# Altium schematic sheet digital led panel.SchDoc
size 369 x 240 mm; SheetNumber: 1; SheetTotal: 1; SPICEModelCacheRHZGLBES: <root> / <DocumentId>RHZGLBES</DocumentId> / </root>
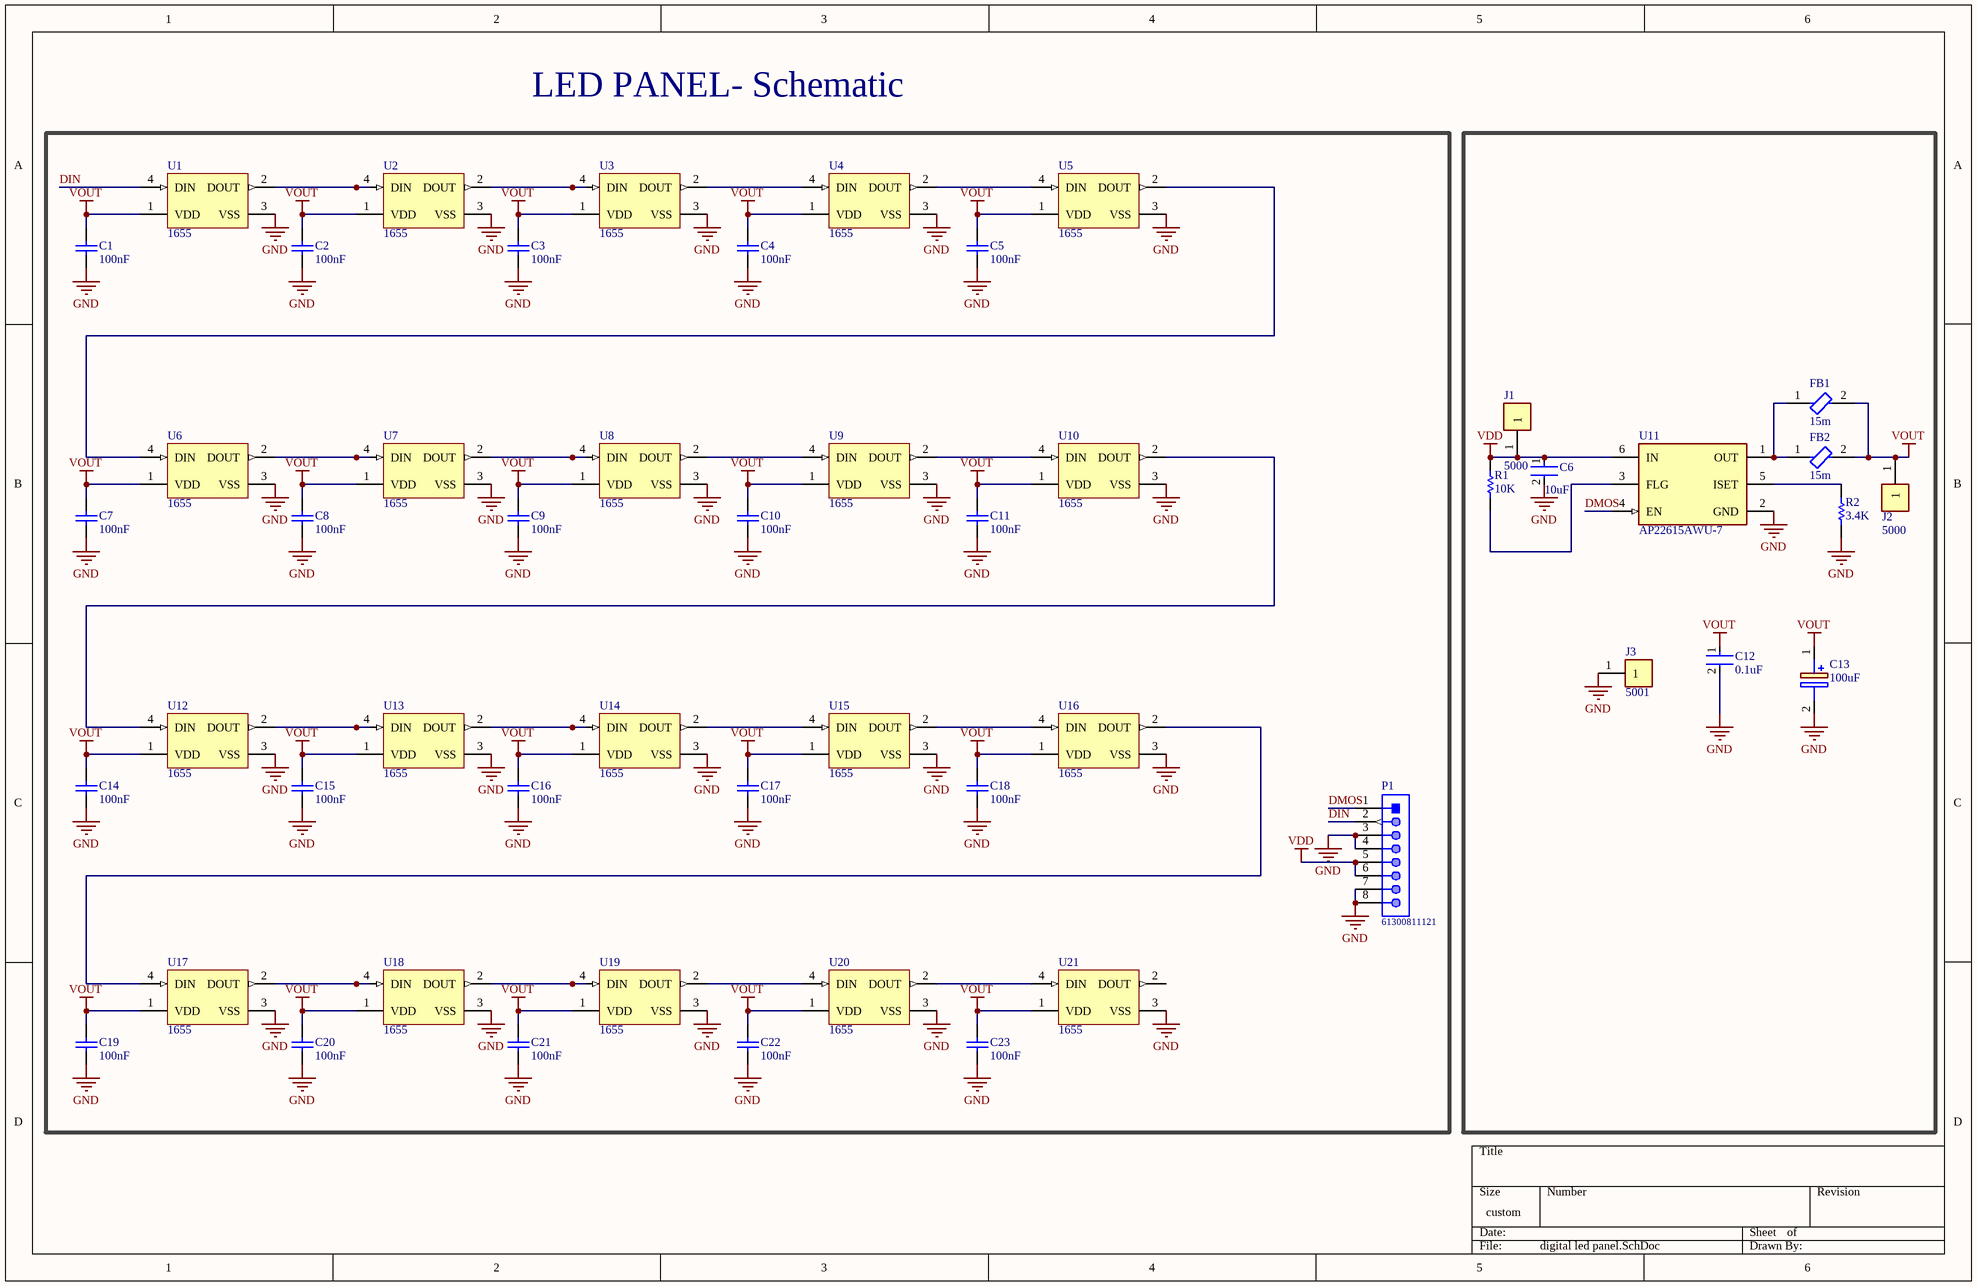
[diagram p0: digital led panel.SchDoc]

## Parts
C1  100nF  [KEMT-1206-2_M]
C2  100nF  [KEMT-1206-2_M]
C3  100nF  [KEMT-1206-2_M]
C4  100nF  [KEMT-1206-2_M]
C5  100nF  [KEMT-1206-2_M]
C6  10uF  [FP-1206-L_3_2_0_2-W_1_6_0-IPC_A]
C7  100nF  [KEMT-1206-2_M]
C8  100nF  [KEMT-1206-2_M]
C9  100nF  [KEMT-1206-2_M]
C10  100nF  [KEMT-1206-2_M]
C11  100nF  [KEMT-1206-2_M]
C12  0.1uF  [FP-C1206C-EB-MFG]
C13  100uF  [CAPAE660X565N]
C14  100nF  [KEMT-1206-2_M]
C15  100nF  [KEMT-1206-2_M]
C16  100nF  [KEMT-1206-2_M]
C17  100nF  [KEMT-1206-2_M]
C18  100nF  [KEMT-1206-2_M]
C19  100nF  [KEMT-1206-2_M]
C20  100nF  [KEMT-1206-2_M]
C21  100nF  [KEMT-1206-2_M]
C22  100nF  [KEMT-1206-2_M]
C23  100nF  [KEMT-1206-2_M]
FB1  15m  [FP-BLM21-0_2-t0_85-e0_5-d-IPC_B]
FB2  15m  [FP-BLM21-0_2-t0_85-e0_5-d-IPC_B]
J1  5000  [FP-5000-MFG]
J2  5000  [FP-5000-MFG]
J3  5001  [FP-5001-MFG]
P1  61300811121  [61300811121]
R1  10K  [RESC3116X65X40ML10T20]
R2  3.4K  [RESC3216X70X50LL05T20]
U1  1655  [ADA-RGB-1655_V]
U2  1655  [ADA-RGB-1655_V]
U3  1655  [ADA-RGB-1655_V]
U4  1655  [ADA-RGB-1655_V]
U5  1655  [ADA-RGB-1655_V]
U6  1655  [ADA-RGB-1655_V]
U7  1655  [ADA-RGB-1655_V]
U8  1655  [ADA-RGB-1655_V]
U9  1655  [ADA-RGB-1655_V]
U10  1655  [ADA-RGB-1655_V]
U11  AP22615AWU-7  [FP-TSOT26-IPC_B]
U12  1655  [ADA-RGB-1655_V]
U13  1655  [ADA-RGB-1655_V]
U14  1655  [ADA-RGB-1655_V]
U15  1655  [ADA-RGB-1655_V]
U16  1655  [ADA-RGB-1655_V]
U17  1655  [ADA-RGB-1655_V]
U18  1655  [ADA-RGB-1655_V]
U19  1655  [ADA-RGB-1655_V]
U20  1655  [ADA-RGB-1655_V]
U21  1655  [ADA-RGB-1655_V]

## Nets
GND: C1.1 C2.1 C3.1 C4.1 C5.1 C6.2 C7.1 C8.1 C9.1 C10.1 C11.1 C12.2 C13.2(-) C14.1 C15.1 C16.1 C17.1 C18.1 C19.1 C20.1 C21.1 C22.1 C23.1 J3.1 P1.3 P1.4 P1.7 P1.8 R2.1 U1.3(VSS) U2.3(VSS) U3.3(VSS) U4.3(VSS) U5.3(VSS) U6.3(VSS) U7.3(VSS) U8.3(VSS) U9.3(VSS) U10.3(VSS) U11.2(GND) U12.3(VSS) U13.3(VSS) U14.3(VSS) U15.3(VSS) U16.3(VSS) U17.3(VSS) U18.3(VSS) U19.3(VSS) U20.3(VSS) U21.3(VSS)
VDD: C6.1 J1.1 P1.5 P1.6 R1.2 U11.6(IN)
VOUT: C1.2 C2.2 C3.2 C4.2 C5.2 C7.2 C8.2 C9.2 C10.2 C11.2 C12.1 C13.1(+) C14.2 C15.2 C16.2 C17.2 C18.2 C19.2 C20.2 C21.2 C22.2 C23.2 FB1.2 FB2.2 J2.1 U1.1(VDD) U2.1(VDD) U3.1(VDD) U4.1(VDD) U5.1(VDD) U6.1(VDD) U7.1(VDD) U8.1(VDD) U9.1(VDD) U10.1(VDD) U12.1(VDD) U13.1(VDD) U14.1(VDD) U15.1(VDD) U16.1(VDD) U17.1(VDD) U18.1(VDD) U19.1(VDD) U20.1(VDD) U21.1(VDD)
DIN: P1.2 U1.4(DIN)
DMOS: P1.1 U11.4(EN)
NetFB1_1: FB1.1 FB2.1 U11.1(OUT)
NetR1_1: R1.1 U11.3(FLG)
NetR2_2: R2.2 U11.5(ISET)
NetU1_2: U1.2(DOUT) U2.4(DIN)
NetU2_2: U2.2(DOUT) U3.4(DIN)
NetU3_2: U3.2(DOUT) U4.4(DIN)
NetU4_2: U4.2(DOUT) U5.4(DIN)
NetU5_2: U5.2(DOUT) U6.4(DIN)
NetU6_2: U6.2(DOUT) U7.4(DIN)
NetU7_2: U7.2(DOUT) U8.4(DIN)
NetU8_2: U8.2(DOUT) U9.4(DIN)
NetU9_2: U9.2(DOUT) U10.4(DIN)
NetU10_2: U10.2(DOUT) U12.4(DIN)
NetU12_2: U12.2(DOUT) U13.4(DIN)
NetU13_2: U13.2(DOUT) U14.4(DIN)
NetU14_2: U14.2(DOUT) U15.4(DIN)
NetU15_2: U15.2(DOUT) U16.4(DIN)
NetU16_2: U16.2(DOUT) U17.4(DIN)
NetU17_2: U17.2(DOUT) U18.4(DIN)
NetU18_2: U18.2(DOUT) U19.4(DIN)
NetU19_2: U19.2(DOUT) U20.4(DIN)
NetU20_2: U20.2(DOUT) U21.4(DIN)

Not connected (* = marked no-connect by the designer): U21 2(DOUT)

## Notes on the sheet
- LED PANEL- Schematic

## Library data of the parts
C1-C5 C7-C11 C14-C23 = CMP-1037-04202-2: CAP, Ceramic, 0.1 uF, +/- 10%, 50 V, -55 to 125 degC, 1206 (3216 Metric), RoHS, Tape and Reel; Manufacturer: Kemet; Voltage Rating: 50V; Capacitance: 0.1µF; Product Range: KEMET-CSeries; SVHC: ToBeAdvised; Dielectric Characteristic: X7R; Capacitor Case Style: 1206[3216Metric]; Package Reference: 1206-2; Package Description: 2-Leads SMD, Body 3.2 x 1.6 mm; Packaging: Tape&Reel; Operating Temperature Max: 125degC; Capacitance Tolerance: ±10%; Datasheet URL: https://datasheet.ciiva.com/6125/1725438-6125494.pdf; Manufacturer URL: http://www.kemet.com/; Operating Temperature Min: -55degC; Datasheet Version: Jul-13
C6 = CMP-04427-021870-1: General Purpose Ceramic Capacitor, 1206, 10uF, 10%, X5R, 15%, 10V; Tolerance: 10%; Thickness: 0.07inch; Voltage: 10V; Termination: SMD/SMT; REACH SVHC: No SVHC; Radiation Hardening: No; Capacitance: 10uF; Lead Free: Lead Free; Min Operating Temperature: -55°C; Contact Plating: Tin; Length: 3.2mm; Dielectric: X5R; Packaging: Tape and Reel; Construction: Flat; RoHS Compliant: Yes; Series: -; Voltage Rating: 10V; Height: 0.07mm; Width: 0.063inch; Voltage Rating (DC): 10V; Mount: Surface Mount; Depth: 1.6mm; Number of Pins: 2; Case Code (Imperial): 1206; Size: 1.78mm; Case/Package: 1206; Max Operating Temperature: 85°C; Package Quantity: 1; Case Code (Metric): 3216
C12 = CMP-03020-000153-1: CAP CER 0.1UF 100V X7R 1206; Manufacturer: KEMET; Manufacturer Part Number: C1206C104K1RACTU; Value: 0.10 μF; Tolerance: 0.1; Material: Ceramic; Temperature Coefficient: 15%; Automotive Grade: Grade 0; Voltage Rating: 100 V; Automotive: Yes; Ipc Land Pattern Name: CAPC320160X78; Device Class L1: Passive Components; ComponentLink2Description: Datasheet; Temperature Range Low: -55°C; Category: Cap; Octopart: https://octopart.com/c1206c104k1ractu-kemet-89521; Height: 0.88mm; Lead Free: Yes; Digikey Description: CAP CER 0.1UF 100V X7R 1206; Mouser Description: CAP CER 0.1UF 100V X7R 1206; Device Class L3: Ceramic Capacitors; Device Class L2: Capacitors; ComponentLink2URL: https://content.kemet.com/datasheets/KEM_C1007_X8R_ULTRA_150C_SMD.pdf; Temperature Range High: +150°C; Temperature Characteristic: X7R; RoHS: TRUE; Capacitance: 0.10 μF; Package: C1206C-EB; Temperature: -55°C to +150°C
C13 = EEV107M016S9GAA: Capacitor Polarised; Manufacturer_Name: KEMET; Datasheet Link: https://content.kemet.com/datasheets/KEM_A4002_EEV.pdf; Height: 5.65mm; Manufacturer_Part_Number: EEV107M016S9GAA; Mouser Part Number: 80-EEV107M016S9GAA; Mouser Price/Stock: https://www.mouser.co.uk/ProductDetail/KEMET/EEV107M016S9GAA?qs=E9QF1UCAUX60VYOwNzsOEA%3D%3D; Arrow Part Number: EEV107M016S9GAA; Arrow Price/Stock: https://www.arrow.com/en/products/eev107m016s9gaa/kemet-corporation?region=nac
FB1 FB2 = CMP-06046-001820-1: Chip Ferrite Bead, 0805, 30Ω @ 100MHz, 0.014Ω, , 4A; Impedance: 30R; Shielding: Unshielded; Max DC Current: 3A; Tolerance: 25%; DC Resistance (DCR): 14mR; Material: Steel; Number of Lines: 1; DC Resistance-Max: 15MR; Core Material: Ferrite; Mount: Surface Mount; Packaging: Tape and Reel; Depth: 1.45mm; Height: 0.041inch; Weight: 0.000194oz; Case Code (Metric): 2012; Ratings: AEC-Q200; Test Frequency: 100MHz; Series: EMIFIL®, BLM21P; Max Operating Temperature: 125°C; Case/Package: 0805; Lead Free: Lead Free; Length: 2mm; REACH SVHC: No SVHC; Case Code (Imperial): 0805; Width: 1.25mm; Package Quantity: 4000; Termination: SMD/SMT; Max Current Rating: 4A; Min Operating Temperature: -55°C; RoHS Compliant: Yes; Current Rating: 3A; Number of Circuits: 1
J1 J2 = CMP-19636-000027-1: PC TEST POINT MINIATURE RED; Outside Diameter: 2.54mm; Body Material: Bronze; Number of Contacts: 1; Insulation: Insulated; Inside Diameter: 1.27mm; Hole Diameter: 1.6mm; Plating: Silver; Length: 7.62mm; Package Quantity: 100; Number of Ports: 1; Contact Material: Bronze; Orientation: Straight; RoHS Compliant: Yes; Housing Color: Red; Height: 0.3inch; Series: THM; Lead Free: Lead Free; Color: Red; Contact Plating: Tin; Mount: PCB; Packaging: Bulk; REACH SVHC: No SVHC; Flammability Rating: UL94 V-0; Material: Nylon
J3 = CMP-2000-05181-2: PC TEST POINT MINIATURE BLACK; Body Material: Bronze; Plating: Silver; Inside Diameter: 1.27mm; Hole Diameter: 1.6mm; Number of Ports: 1; Outside Diameter: 2.54mm; Insulation: Insulated; Insulation Material: Nylon; Mount: Through Hole; RoHS Compliant: Yes; Series: THM; Height: 0.3inch; Termination: Through Hole; Material: Nylon; Packaging: Bulk; Contact Material: Bronze; REACH SVHC: No SVHC; Contact Plating: Silver; Orientation: Straight; Lead Free: Lead Free; Package Quantity: 100; Length: 7.62mm; Flammability Rating: UL94 V-0; Number of Contacts: 1; Diameter: 2.54mm; Housing Color: Black; Color: Black
P1 = CMP-1502-01076-1: THT Vertical Pin Header WR-PHD, Pitch 2.54 mm, Single Row, 8 pins; Manufacturer: Wurth Elektronik; Rated Current: 3A; Pin Number: 8; Working Voltage: 250VAC; Gender: Male; Contact Resistance: 20mOhm; Pitch: 2.54mm; Withstanding Voltage: 500VAC; Publisher: WurthElektronik; Operating Temperature: -40to105degC; Orientation: Vertical; Row Number: Single; Part Number: 61300811121; Package Reference: 61300811121; Mounting Technology: THT; Packaging: Bag; Manufacturer URL: http://www.we-online.de; Datasheet URL: https://katalog.we-online.de/em/datasheet/6130xx11121.pdf
R1 = CMP-1014-00623-2: Chip Resistor, 10 KOhm, +/- 1%, 0.25 W, -55 to 155 degC, 1206 (3216 Metric), RoHS, Tape and Reel; Manufacturer: Yageo; Voltage Rating: 200V; Resistance: 10KOhm; Temperature Coefficient: 100ppm/degreesC; Power Rating: 250mW; Packaging: TapeandReel; Termination: SMD/SMT; REACH SVHC: Unknown; Tolerance: 1%; Height: 0.55mm; Composition: ThickFilm; Max Operating Temperature: 155degC; Datasheet Version: Rev. 5, 10/2016; Lead Free: LeadFree; Case Code (Metric): 3216; Depth: 1.6mm; Package Quantity: 5000; RoHSCompliant: true; Military Standard: Not; Case/Package: 1206; Case Code (Imperial): 1206; Min Operating Temperature: -55degC; Datasheet URL: http://www.yageo.com/NewPortal/yageodocoutput?fileName=/pdf/R-Chip/PYu-RC_Group_51_RoHS_L_5.pdf; Length: 3.1mm; Manufacturer URL: http://www.yageo.com/; Package Reference: 1206.0; Width: 1.6mm; Package Description: 2-Pin Surface Mount Device, Body 3.1 x 1.6 mm
R2 = CMP-2003-00314-1: Part Number: ERJ-8ENF3401V; Manufacturer: Panasonic
U1-U10 U12-U21 = CMP-2000-05026-1: Intelligent Control LED Integrated Light Source, 3.5 to 5.3 V, -25 to 80 degC, 4-Pin SMD, RoHS, Tape and Reel; Manufacturer: Adafruit-Industries-LLC; Number of LEDs: 10; Configuration: Discrete; Utilized LED: WS2812(5050); Datasheet URL: http://datasheet.octopart.com/ADA1655-Adafruit-Industries-datasheet-32028139.pdf; Series: Neopixel; Interface: -; Package Description: 4-Pin Surface Mount Device, Body 5 x 5 mm; Color: Red,Green,Blue(RGB); Category: Optoelectronics; Controller Type: -; Package Reference: 1655; Manufacturer URL: https://www.adafruit.com/; Mounting Type: SurfaceMount; Datasheet Version: May-13; Size / Dimension: 5.00mmLx5.00mmW; Family: Addressable,Specialty
U11 = CMP-12757-000023-1: IC PWR SWTCH N/P-CHAN 1:1 TSOT26; RoHS Compliant: Yes